# Altium schematic sheet Sheet1.SchDoc
size A
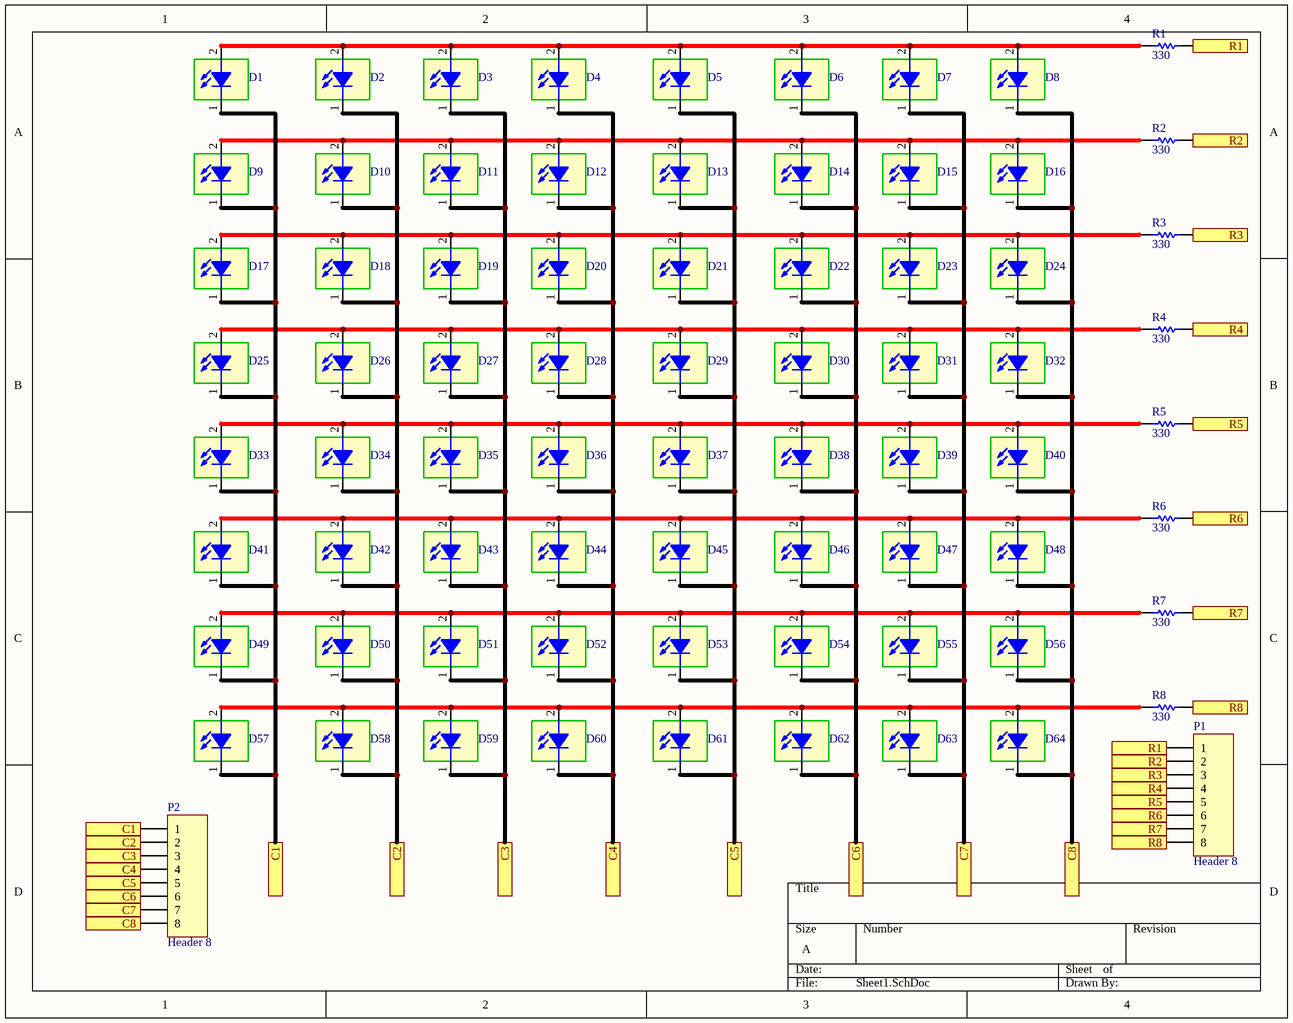
[diagram p0: Sheet1.SchDoc]

## Parts
D1  SMD 1206 LED  [LED 1206]  (value not drawn)
D2  SMD 1206 LED  [LED 1206]  (value not drawn)
D3  SMD 1206 LED  [LED 1206]  (value not drawn)
D4  SMD 1206 LED  [LED 1206]  (value not drawn)
D5  SMD 1206 LED  [LED 1206]  (value not drawn)
D6  SMD 1206 LED  [LED 1206]  (value not drawn)
D7  SMD 1206 LED  [LED 1206]  (value not drawn)
D8  SMD 1206 LED  [LED 1206]  (value not drawn)
D9  SMD 1206 LED  [LED 1206]  (value not drawn)
D10  SMD 1206 LED  [LED 1206]  (value not drawn)
D11  SMD 1206 LED  [LED 1206]  (value not drawn)
D12  SMD 1206 LED  [LED 1206]  (value not drawn)
D13  SMD 1206 LED  [LED 1206]  (value not drawn)
D14  SMD 1206 LED  [LED 1206]  (value not drawn)
D15  SMD 1206 LED  [LED 1206]  (value not drawn)
D16  SMD 1206 LED  [LED 1206]  (value not drawn)
D17  SMD 1206 LED  [LED 1206]  (value not drawn)
D18  SMD 1206 LED  [LED 1206]  (value not drawn)
D19  SMD 1206 LED  [LED 1206]  (value not drawn)
D20  SMD 1206 LED  [LED 1206]  (value not drawn)
D21  SMD 1206 LED  [LED 1206]  (value not drawn)
D22  SMD 1206 LED  [LED 1206]  (value not drawn)
D23  SMD 1206 LED  [LED 1206]  (value not drawn)
D24  SMD 1206 LED  [LED 1206]  (value not drawn)
D25  SMD 1206 LED  [LED 1206]  (value not drawn)
D26  SMD 1206 LED  [LED 1206]  (value not drawn)
D27  SMD 1206 LED  [LED 1206]  (value not drawn)
D28  SMD 1206 LED  [LED 1206]  (value not drawn)
D29  SMD 1206 LED  [LED 1206]  (value not drawn)
D30  SMD 1206 LED  [LED 1206]  (value not drawn)
D31  SMD 1206 LED  [LED 1206]  (value not drawn)
D32  SMD 1206 LED  [LED 1206]  (value not drawn)
D33  SMD 1206 LED  [LED 1206]  (value not drawn)
D34  SMD 1206 LED  [LED 1206]  (value not drawn)
D35  SMD 1206 LED  [LED 1206]  (value not drawn)
D36  SMD 1206 LED  [LED 1206]  (value not drawn)
D37  SMD 1206 LED  [LED 1206]  (value not drawn)
D38  SMD 1206 LED  [LED 1206]  (value not drawn)
D39  SMD 1206 LED  [LED 1206]  (value not drawn)
D40  SMD 1206 LED  [LED 1206]  (value not drawn)
D41  SMD 1206 LED  [LED 1206]  (value not drawn)
D42  SMD 1206 LED  [LED 1206]  (value not drawn)
D43  SMD 1206 LED  [LED 1206]  (value not drawn)
D44  SMD 1206 LED  [LED 1206]  (value not drawn)
D45  SMD 1206 LED  [LED 1206]  (value not drawn)
D46  SMD 1206 LED  [LED 1206]  (value not drawn)
D47  SMD 1206 LED  [LED 1206]  (value not drawn)
D48  SMD 1206 LED  [LED 1206]  (value not drawn)
D49  SMD 1206 LED  [LED 1206]  (value not drawn)
D50  SMD 1206 LED  [LED 1206]  (value not drawn)
D51  SMD 1206 LED  [LED 1206]  (value not drawn)
D52  SMD 1206 LED  [LED 1206]  (value not drawn)
D53  SMD 1206 LED  [LED 1206]  (value not drawn)
D54  SMD 1206 LED  [LED 1206]  (value not drawn)
D55  SMD 1206 LED  [LED 1206]  (value not drawn)
D56  SMD 1206 LED  [LED 1206]  (value not drawn)
D57  SMD 1206 LED  [LED 1206]  (value not drawn)
D58  SMD 1206 LED  [LED 1206]  (value not drawn)
D59  SMD 1206 LED  [LED 1206]  (value not drawn)
D60  SMD 1206 LED  [LED 1206]  (value not drawn)
D61  SMD 1206 LED  [LED 1206]  (value not drawn)
D62  SMD 1206 LED  [LED 1206]  (value not drawn)
D63  SMD 1206 LED  [LED 1206]  (value not drawn)
D64  SMD 1206 LED  [LED 1206]  (value not drawn)
P1  Header 8  [HDR1X8]
P2  Header 8  [HDR1X8]
R1  330  [RES1206]
R2  330  [RES1206]
R3  330  [RES1206]
R4  330  [RES1206]
R5  330  [RES1206]
R6  330  [RES1206]
R7  330  [RES1206]
R8  330  [RES1206]

## Ports
C1, C2, C3, C4, C5, C6, C7, C8, R1, R2, R3, R4, R5, R6, R7, R8

## Nets
C1: D1.1 D9.1 D17.1 D25.1 D33.1 D41.1 D49.1 D57.1 P2.1 ; port C1
C2: D2.1 D10.1 D18.1 D26.1 D34.1 D42.1 D50.1 D58.1 P2.2 ; port C2
C3: D3.1 D11.1 D19.1 D27.1 D35.1 D43.1 D51.1 D59.1 P2.3 ; port C3
C4: D4.1 D12.1 D20.1 D28.1 D36.1 D44.1 D52.1 D60.1 P2.4 ; port C4
C5: D5.1 D13.1 D21.1 D29.1 D37.1 D45.1 D53.1 D61.1 P2.5 ; port C5
C6: D6.1 D14.1 D22.1 D30.1 D38.1 D46.1 D54.1 D62.1 P2.6 ; port C6
C7: D7.1 D15.1 D23.1 D31.1 D39.1 D47.1 D55.1 D63.1 P2.7 ; port C7
C8: D8.1 D16.1 D24.1 D32.1 D40.1 D48.1 D56.1 D64.1 P2.8 ; port C8
R1: P1.1 R1.1 ; port R1
R2: P1.2 R2.1 ; port R2
R3: P1.3 R3.1 ; port R3
R4: P1.4 R4.1 ; port R4
R5: P1.5 R5.1 ; port R5
R6: P1.6 R6.1 ; port R6
R7: P1.7 R7.1 ; port R7
R8: P1.8 R8.1 ; port R8
NetD1_2: D1.2 D2.2 D3.2 D4.2 D5.2 D6.2 D7.2 D8.2 R1.2
NetD9_2: D9.2 D10.2 D11.2 D12.2 D13.2 D14.2 D15.2 D16.2 R2.2
NetD17_2: D17.2 D18.2 D19.2 D20.2 D21.2 D22.2 D23.2 D24.2 R3.2
NetD25_2: D25.2 D26.2 D27.2 D28.2 D29.2 D30.2 D31.2 D32.2 R4.2
NetD33_2: D33.2 D34.2 D35.2 D36.2 D37.2 D38.2 D39.2 D40.2 R5.2
NetD41_2: D41.2 D42.2 D43.2 D44.2 D45.2 D46.2 D47.2 D48.2 R6.2
NetD49_2: D49.2 D50.2 D51.2 D52.2 D53.2 D54.2 D55.2 D56.2 R7.2
NetD57_2: D57.2 D58.2 D59.2 D60.2 D61.2 D62.2 D63.2 D64.2 R8.2

## Library data of the parts
D1-D64 = LED SMD 1206
P1 P2 = Header 8: Header, 8-Pin; LatestRevisionDate: 17-Jul-2002; LatestRevisionNote: Re-released for DXP Platform.; Publisher: Altium Limited
R1-R8 = RES SMD PACKAGE: TOTAL SMD RESISTOR PACK; Designer: Abbas Basereh; Desc.: RES SMD PAKAGES; Data: 2017-3-10